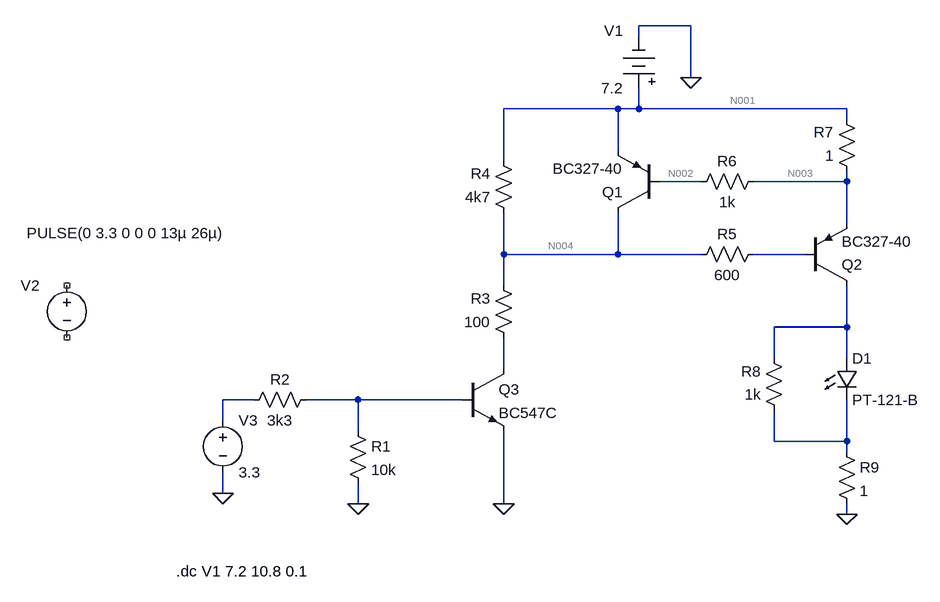
[diagram p0: schematic IR-Led-Constant_Current_old.asc]
IR-Led-Constant_Current_old.asc, the LTspice schematic file:
Version 4
SHEET 1 1664 680
WIRE 672 -464 592 -464
WIRE 592 -448 592 -464
WIRE 672 -384 672 -464
WIRE 560 -336 384 -336
WIRE 592 -336 592 -368
WIRE 592 -336 560 -336
WIRE 912 -336 592 -336
WIRE 912 -320 912 -336
WIRE 560 -272 560 -336
WIRE 384 -256 384 -336
WIRE 688 -224 624 -224
WIRE 912 -224 912 -240
WIRE 912 -224 768 -224
WIRE 912 -160 912 -224
WIRE 384 -112 384 -176
WIRE 560 -112 560 -176
WIRE 560 -112 384 -112
WIRE 688 -112 560 -112
WIRE 848 -112 768 -112
WIRE 384 -64 384 -112
WIRE 912 0 912 -64
WIRE 912 0 800 0
WIRE 800 48 800 0
WIRE 912 48 912 0
WIRE 384 64 384 16
WIRE 0 112 -48 112
WIRE 160 112 80 112
WIRE 320 112 160 112
WIRE -48 144 -48 112
WIRE 160 160 160 112
WIRE 800 176 800 128
WIRE 912 176 912 112
WIRE 912 176 800 176
WIRE 912 192 912 176
WIRE -48 256 -48 224
WIRE 160 272 160 240
WIRE 384 272 384 160
WIRE 912 288 912 272
FLAG 160 272 0
FLAG 384 272 0
FLAG 912 288 0
FLAG 672 -384 0
FLAG -48 256 0
SYMBOL res 144 144 R0
SYMATTR InstName R1
SYMATTR Value 10k
SYMBOL res 96 96 R90
WINDOW 0 0 56 VBottom 2
WINDOW 3 32 56 VTop 2
SYMATTR InstName R2
SYMATTR Value 3k3
SYMBOL res 400 32 R180
WINDOW 0 36 76 Left 2
WINDOW 3 36 40 Left 2
SYMATTR InstName R3
SYMATTR Value 100
SYMBOL res 400 -160 R180
WINDOW 0 36 76 Left 2
WINDOW 3 36 40 Left 2
SYMATTR InstName R4
SYMATTR Value 4k7
SYMBOL res 784 -128 R90
WINDOW 0 0 56 VBottom 2
WINDOW 3 32 56 VTop 2
SYMATTR InstName R5
SYMATTR Value 600
SYMBOL res 784 -240 R90
WINDOW 0 0 56 VBottom 2
WINDOW 3 32 56 VTop 2
SYMATTR InstName R6
SYMATTR Value 1k
SYMBOL res 928 -224 R180
WINDOW 0 36 76 Left 2
WINDOW 3 36 40 Left 2
SYMATTR InstName R7
SYMATTR Value 1
SYMBOL res 816 144 R180
WINDOW 0 36 76 Left 2
WINDOW 3 36 40 Left 2
SYMATTR InstName R8
SYMATTR Value 1k
SYMBOL res 896 176 R0
SYMATTR InstName R9
SYMATTR Value 1
SYMBOL pnp 624 -176 R180
SYMATTR InstName Q1
SYMATTR Value BC327-40
SYMBOL pnp 848 -64 M180
SYMATTR InstName Q2
SYMATTR Value BC327-40
SYMBOL npn 320 64 R0
SYMATTR InstName Q3
SYMATTR Value BC547C
SYMBOL Misc\\battery 592 -352 R180
WINDOW 0 24 104 Left 2
WINDOW 3 24 16 Left 2
WINDOW 123 0 0 Left 0
WINDOW 39 0 0 Left 0
SYMATTR InstName V1
SYMATTR Value 7.2
SYMBOL voltage -288 -80 R0
WINDOW 0 -71 16 Left 2
WINDOW 3 -62 -65 Left 2
WINDOW 123 0 0 Left 0
WINDOW 39 0 0 Left 0
SYMATTR InstName V2
SYMATTR Value PULSE(0 3.3 0 0 0 13µ 26µ)
SYMBOL LED 896 48 R0
SYMATTR InstName D1
SYMATTR Value PT-121-B
SYMBOL voltage -48 128 R0
WINDOW 123 0 0 Left 0
WINDOW 39 0 0 Left 0
SYMATTR InstName V3
SYMATTR Value 3.3
TEXT -120 376 Left 2 !.dc V1 7.2 10.8 0.1

The netlist it stands for:
* IR-Led-Constant_Current_old.asc
R1 N009 0 10k
R2 N009 N008 3k3
R3 N007 N004 100
R4 N004 N001 4k7
R5 N005 N004 600
R6 N003 N002 1k
R7 N003 N001 1
R8 N010 N006 1k
R9 N010 0 1
Q1 N004 N002 N001 0 BC327-40
Q2 N006 N005 N003 0 BC327-40
Q3 N007 N009 0 0 BC547C
V1 N001 0 7.2
V2 NC_01 NC_02 PULSE(0 3.3 0 0 0 13µ 26µ)
D1 N006 N010 PT-121-B
V3 N008 0 3.3
.model D D
.lib standard.dio
.model NPN NPN
.model PNP PNP
.lib standard.bjt
.dc V1 7.2 10.8 0.1
.backanno
.end

* Results of the author's LTspice run, read from the files saved beside the schematic
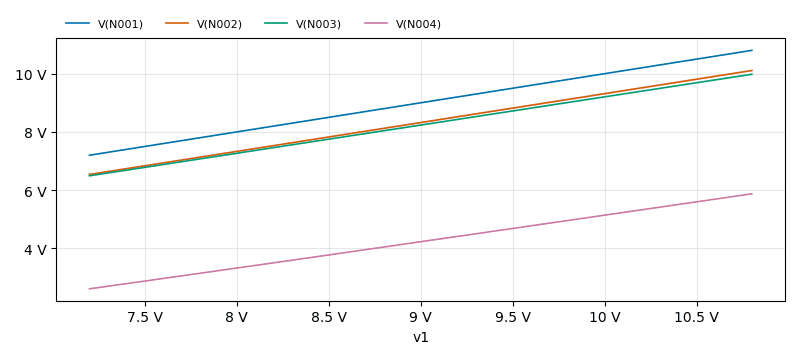
[diagram p1: DC transfer characteristic of IR-Led-Constant_Current_old.asc, plotted from the saved traces]
* DC transfer characteristic, 1 run:
*   V(N001): 7.2 V at v1=7.2 V, 10.8 V at v1=10.8 V, min 7.2 V, max 10.8 V
*   V(N002): 6.54 V at v1=7.2 V, 10.11 V at v1=10.8 V, min 6.54 V, max 10.11 V
*   V(N003): 6.494 V at v1=7.2 V, 9.98 V at v1=10.8 V, min 6.494 V, max 9.98 V
*   V(N004): 2.615 V at v1=7.2 V, 5.876 V at v1=10.8 V, min 2.615 V, max 5.876 V